# Altium schematic sheet Power stage.SchDoc (part 2 of 3)
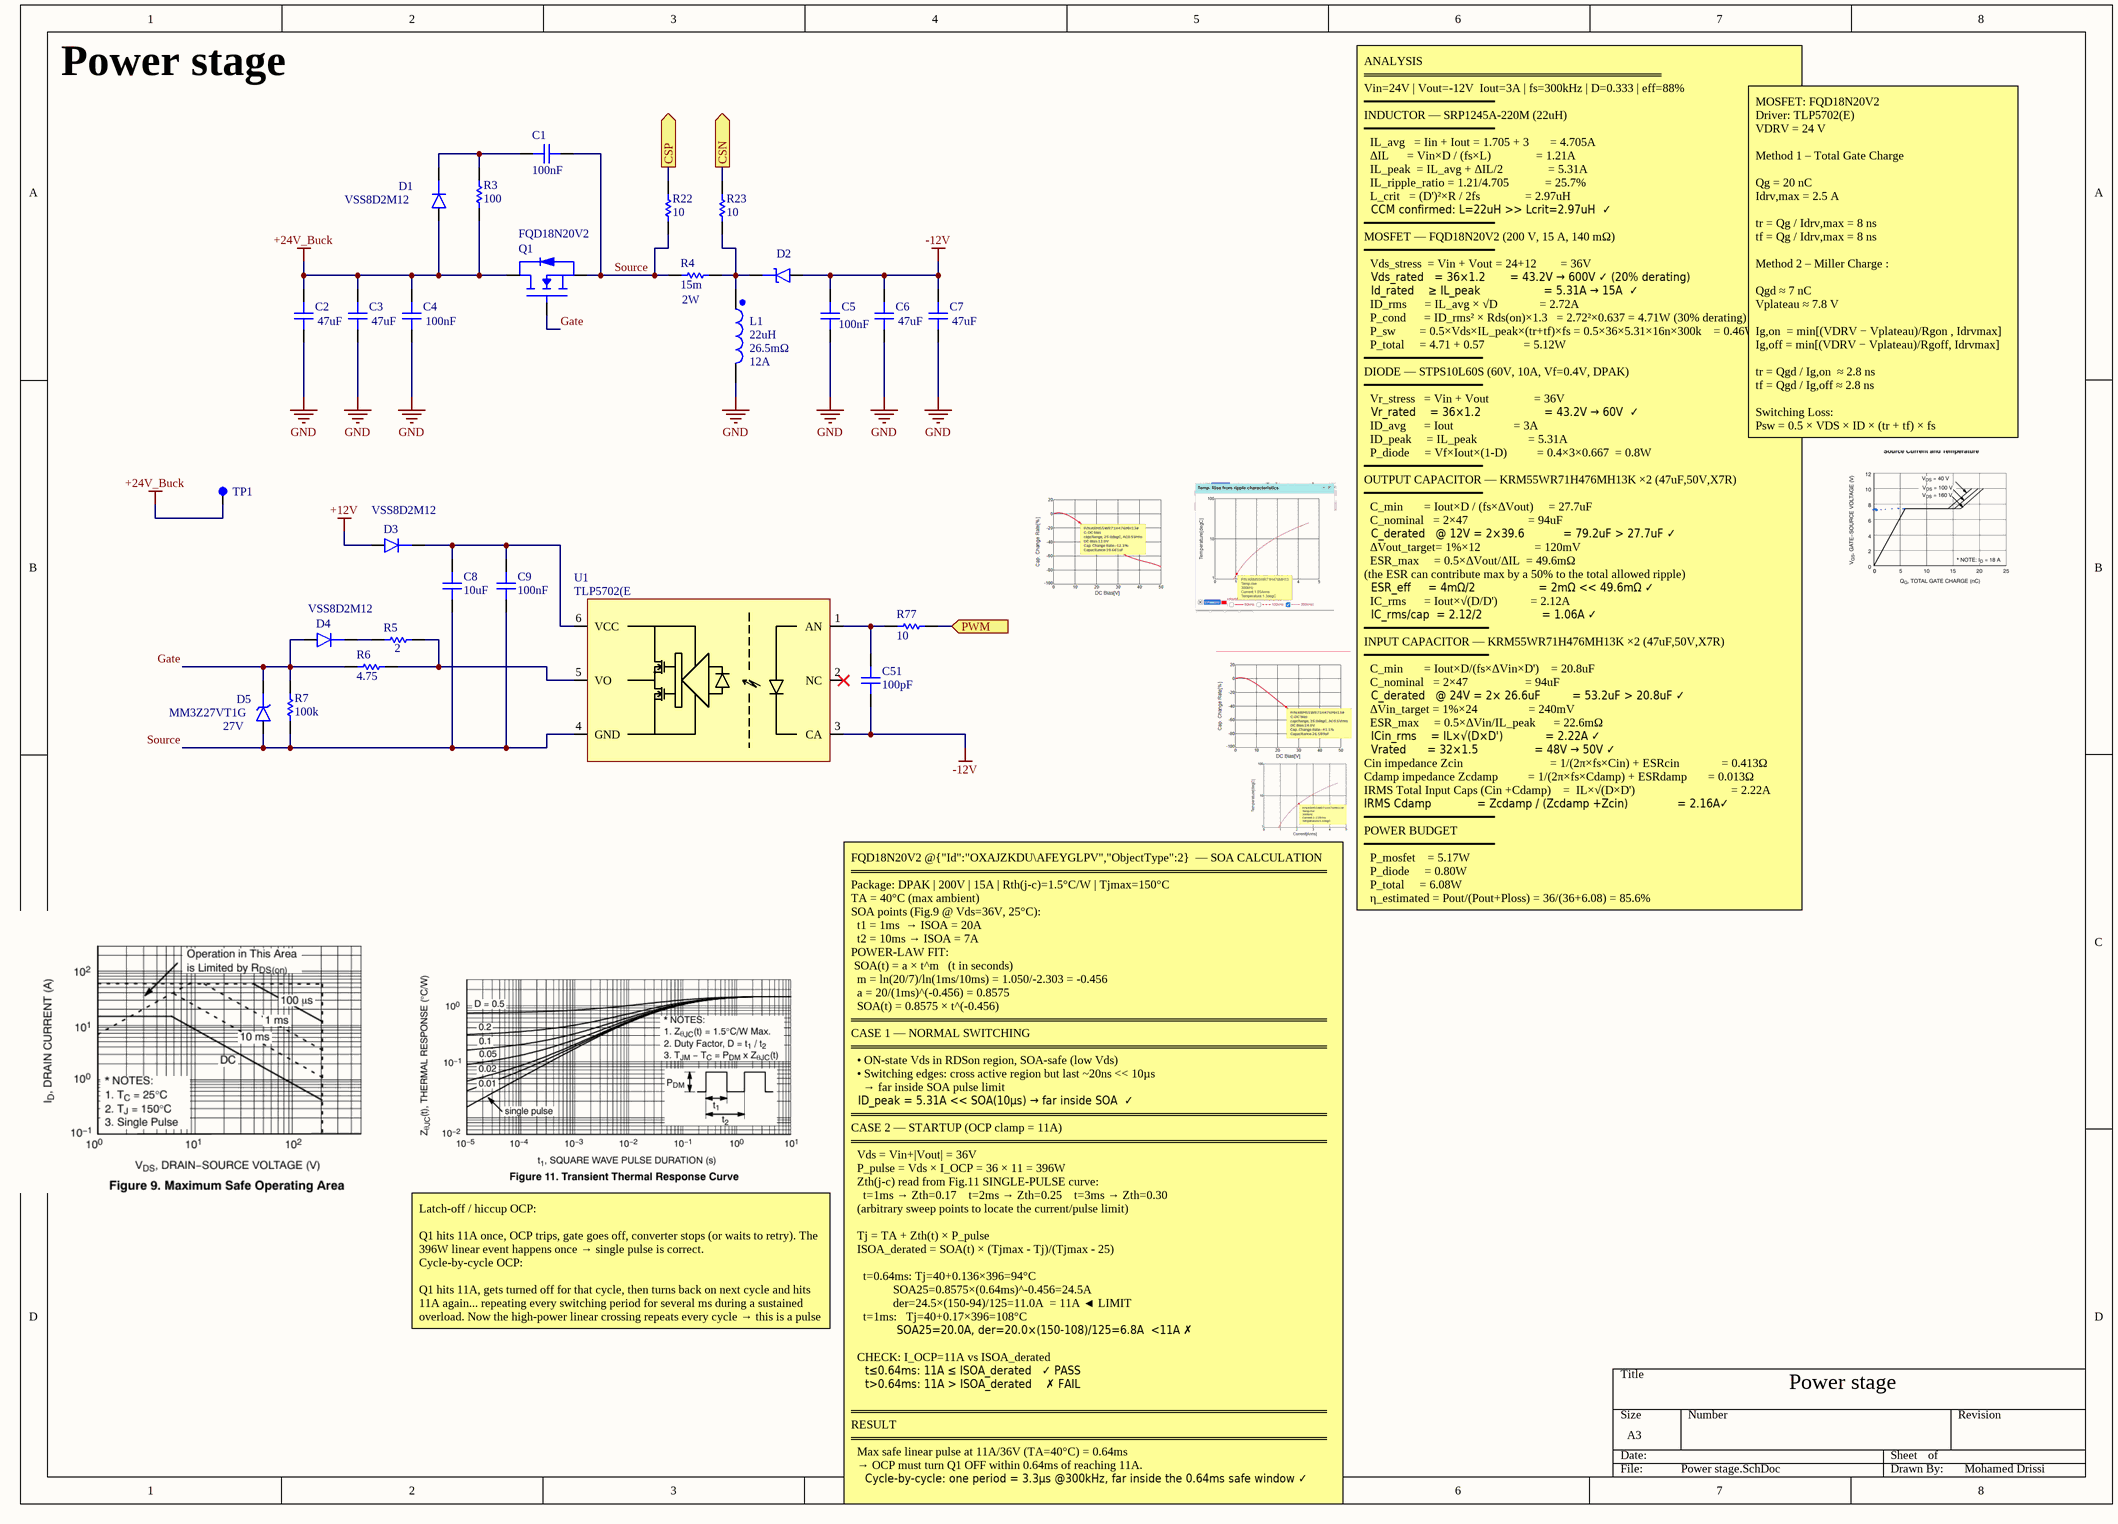
[diagram p1: Power stage.SchDoc]
## Library data of the parts
C1 C4 C5 C9 = Cal-chip GMC10X7R104K100NT: 100V 100nF X7R ±10% 0603 Multilayer Ceramic Capacitors MLCC - SMD/SMT ROHS; Manufacturer: Cal-Chip Electronics; Supplier: DigiKey; Supplier Part Number: 4713-GMC10X7R104K100NTCT-ND; Manufacturer Part Number: GMC10X7R104K100NT; RoHS: Compliant; Category: Ceramic Capacitors; Stock: 34767; Pricing: 1=0,1, 10=0,045, 50=0,0306, 100=0,0262, 500=0,01902, 1000=0,0168 (USD); Case/Package: 0603; China RoHS: Compliant; Dielectric Material: Ceramic; Height: 950µm; Length: 1.6mm; Lifecycle Status: Production; Max Operating Temperature: 125°C; Min Operating Temperature: -55°C; Mounting Technology: Surface Mount; Number of Terminals: 2; REACH SVHC: Yes; Voltage Rating (DC): 100V; Width: 800µm; ComponentLink1URL: https://datasheet.octopart.com:443/GMC10X7R104K100NT-Cal-Chip-Electronics-datasheet-182028815.pdf?src-supplier=IHS; ComponentLink1Description: https://datasheet.octopart.com:443/GMC10X7R104K100NT-Cal-Chip-Electronics-datasheet-182028815.pdf?src-supplier=IHS
C2 C3 C6 C7 = Murata KRM55WR71H476MH13K: Multilayer Ceramic Capacitors MLCC - SMD/SMT 47uF 50VDC 20% X7R; Manufacturer: Murata; Voltage Rating: 50V; Supplier: DigiKey; Supplier Part Number: 490-KRM55WR71H476MH13KCT-ND; Manufacturer Part Number: KRM55WR71H476MH13K; RoHS: Compliant; Category: Ceramic Capacitors; Stock: 10136; Pricing: 1=4,98, 10=3,591, 50=3,0356, 100=2,8638 (USD); Case/Package: 2220; Dielectric: X7R; Dielectric Material: Ceramic; Height: 6.4mm; Length: 6.1mm; Lifecycle Status: Production; Material: Ceramic; Max Operating Temperature: 125°C; Min Operating Temperature: -55°C; Mounting Technology: Surface Mount; Number of Terminals: 2; REACH SVHC: Yes; Thickness: 6.4mm; Tolerance: 20%; Voltage Rating (DC): 50V; Width: 5.3mm; ComponentLink1URL: https://datasheet.octopart.com/KRM55WR71H476MH13K-Murata-datasheet-12515295.pdf; ComponentLink1Description: https://datasheet.octopart.com/KRM55WR71H476MH13K-Murata-datasheet-12515295.pdf; ComponentLink2URL: https://datasheet.octopart.com/KRM55WR71H476MH13K-Murata-datasheet-12510076.pdf; ComponentLink2Description: https://datasheet.octopart.com/KRM55WR71H476MH13K-Murata-datasheet-12510076.pdf; ComponentLink3URL: https://datasheet.octopart.com/KRM55WR71H476MH13K-Murata-datasheet-11978611.pdf; ComponentLink3Description: https://datasheet.octopart.com/KRM55WR71H476MH13K-Murata-datasheet-11978611.pdf; ComponentLink4URL: https://datasheet.octopart.com/KRM55WR71H476MH13K-Murata-datasheet-10025737.pdf; ComponentLink4Description: https://datasheet.octopart.com/KRM55WR71H476MH13K-Murata-datasheet-10025737.pdf; ComponentLink5URL: https://datasheet.octopart.com/KRM55WR71H476MH13K-Murata-datasheet-8819587.pdf; ComponentLink5Description: https://datasheet.octopart.com/KRM55WR71H476MH13K-Murata-datasheet-8819587.pdf; ComponentLink6URL: http://sigma.octopart.com:80/reach_statement/Murata-company-16.pdf?src-supplier=Compliance+Statements; ComponentLink6Description: http://sigma.octopart.com:80/reach_statement/Murata-company-16.pdf?src-supplier=Compliance+Statements
C8 = Wurth 885012209073: Cap, 10Uf, 50V, Mlcc, 1210 Rohs Compliant: Yes |Würth Elektronik 885012209073; Manufacturer: Wurth Elektronik; Manufacturer Lifecycle Status: ACTIVE; Insulation Resistance: 10MΩ; Material: Ceramic; Tolerance: 10%; YEOL: 1 = Estimated lifetime > 10 years; Supplier: RS; Supplier Part Number: 2571123; Manufacturer Part Number: 885012209073; RoHS: Compliant; Category: Ceramic Capacitors; Stock: 1289; Pricing: 10=1,153, 100=1,081, 200=1,009, 400=0,851, 500=0,799 (EUR); Case/Package: 1210; Height: 2.5mm; Length: 3.2mm; Lifecycle Status: Production; Max Operating Temperature: 125°C; Min Operating Temperature: -55°C; Voltage Rating: 50V; Width: 2.5mm; ComponentLink1URL: https://datasheet.octopart.com:443/885012209073-Wurth-Elektronik-datasheet-166092699.pdf?src-supplier=Newark; ComponentLink1Description: https://datasheet.octopart.com:443/885012209073-Wurth-Elektronik-datasheet-166092699.pdf?src-supplier=Newark; ComponentLink2URL: https://datasheet.octopart.com:443/885012209073-W%C3%BCrth-Elektronik-datasheet-137006727.pdf?src-supplier=Wurth+Elektronik; ComponentLink2Description: https://datasheet.octopart.com:443/885012209073-W%C3%BCrth-Elektronik-datasheet-137006727.pdf?src-supplier=Wurth+Elektronik
C51 = Murata GCM1885C2A101JA16D: 100V 100pF C0G ±5% 0603 Multilayer Ceramic Capacitors MLCC - SMD/SMT ROHS; Manufacturer: Murata; Manufacturer Lifecycle Status: IN PRODUCTION; Temperature Coefficient: 30ppm/°C; Supplier: RS; Supplier Part Number: 8151323P; Manufacturer Part Number: GCM1885C2A101JA16D; RoHS: Compliant; Category: Ceramic Capacitors; Stock: 11200; Pricing: 1000=0,018, 2000=0,017, 5000=0,016, 10000=0,014 (EUR); Case/Package: 0603; Case Code (Imperial): 0603; Case Code (Metric): 1608; Depth: 800µm; Dielectric: C0G; Dielectric Material: Ceramic; Height: 800µm; Lead Free: Lead Free; Length: 1.6mm; Lifecycle Status: Production; Material: Ceramic; Max Operating Temperature: 125°C; Min Operating Temperature: -55°C; Mounting Technology: Surface Mount; Number of Terminals: 2; Radiation Hardening: No; Ratings: AEC-Q200; REACH SVHC: Yes; Schedule B: 8532240020, 8532240020|8532240020, 8532240020|8532240020|8532240020, 8532240020|8532240020|8532240020|8532240020; Termination: SMD/SMT; Tolerance: 5%; Voltage: 100V; Voltage Rating: 100V; Voltage Rating (DC): 100V; Width: 800µm; ComponentLink1URL: https://datasheet.octopart.com:443/GCM1885C2A101JA16D-Murata-datasheet-149522598.pdf?src-supplier=Farnell; ComponentLink1Description: https://datasheet.octopart.com:443/GCM1885C2A101JA16D-Murata-datasheet-149522598.pdf?src-supplier=Farnell; ComponentLink2URL: https://datasheet.octopart.com:443/GCM1885C2A101JA16D-Murata-datasheet-104277829.pdf?src-supplier=Newark; ComponentLink2Description: https://datasheet.octopart.com:443/GCM1885C2A101JA16D-Murata-datasheet-104277829.pdf?src-supplier=Newark; ComponentLink3URL: https://datasheet.octopart.com:443/GCM1885C2A101JA16D-Murata-datasheet-141266551.pdf?src-supplier=Geoflip; ComponentLink3Description: https://datasheet.octopart.com:443/GCM1885C2A101JA16D-Murata-datasheet-141266551.pdf?src-supplier=Geoflip; ComponentLink4URL: https://datasheet.octopart.com:443/GCM1885C2A101JA16D-Murata-datasheet-14404397.pdf?src-supplier=Future+Electronics; ComponentLink4Description: https://datasheet.octopart.com:443/GCM1885C2A101JA16D-Murata-datasheet-14404397.pdf?src-supplier=Future+Electronics; ComponentLink5URL: https://datasheet.octopart.com:443/GCM1885C2A101JA16D-Murata-datasheet-12524712.pdf?src-supplier=Future+Electronics; ComponentLink5Description: https://datasheet.octopart.com:443/GCM1885C2A101JA16D-Murata-datasheet-12524712.pdf?src-supplier=Future+Electronics; ComponentLink6URL: https://datasheet.octopart.com:443/GCM1885C2A101JA16D-Murata-datasheet-44104441.pdf?src-supplier=Future+Electronics; ComponentLink6Description: https://datasheet.octopart.com:443/GCM1885C2A101JA16D-Murata-datasheet-44104441.pdf?src-supplier=Future+Electronics; ComponentLink7URL: https://datasheet.octopart.com:443/GCM1885C2A101JA16D-Murata-datasheet-140657395.pdf?src-supplier=Ciiva; ComponentLink7Description: https://datasheet.octopart.com:443/GCM1885C2A101JA16D-Murata-datasheet-140657395.pdf?src-supplier=Ciiva; ComponentLink8URL: https://datasheet.octopart.com:443/GCM1885C2A101JA16D-Murata-datasheet-138717052.pdf?src-supplier=Ciiva; ComponentLink8Description: https://datasheet.octopart.com:443/GCM1885C2A101JA16D-Murata-datasheet-138717052.pdf?src-supplier=Ciiva; ComponentLink9URL: https://datasheet.octopart.com:443/GCM1885C2A101JA16D-Murata-datasheet-141971842.pdf?src-supplier=Arrow.cn; ComponentLink9Description: https://datasheet.octopart.com:443/GCM1885C2A101JA16D-Murata-datasheet-141971842.pdf?src-supplier=Arrow.cn; ComponentLink10URL: https://datasheet.octopart.com:443/GCM1885C2A101JA16D-Murata-datasheet-12511495.pdf?src-supplier=TME; ComponentLink10Description: https://datasheet.octopart.com:443/GCM1885C2A101JA16D-Murata-datasheet-12511495.pdf?src-supplier=TME; ComponentLink11URL: http://sigma.octopart.com:80/reach_statement/Murata-company-16.pdf?src-supplier=Compliance+Statements; ComponentLink11Description: http://sigma.octopart.com:80/reach_statement/Murata-company-16.pdf?src-supplier=Compliance+Statements
D1 D3 D4 = Vishay VSS8D2M12-M3/H: Rectifier Diode, Schottky, 1 Phase, 1 Element, 2A, 120V V(RRM), Silicon, DO-221AD; Manufacturer: Vishay; Forward Voltage: 810mV; Max Forward Surge Current (Ifsm): 50A; Number of Elements: 1; Peak Reverse Current: 250µA; Supplier: RS; Supplier Part Number: 2190367; Manufacturer Part Number: VSS8D2M12-M3/H; RoHS: Compliant; Category: Rectifier Diodes; Stock: 13750; Pricing: 50=0,204 (EUR); Lifecycle Status: Production; Max Operating Temperature: 175°C; Max Output current: 2A; Min Operating Temperature: -40°C; Number of Terminals: 2; Reverse Standoff Voltage: 120V; ComponentLink1URL: https://datasheet.octopart.com:443/VSS8D2M12-M3-H-Vishay-datasheet-181480222.pdf?src-supplier=Newark; ComponentLink1Description: https://datasheet.octopart.com:443/VSS8D2M12-M3-H-Vishay-datasheet-181480222.pdf?src-supplier=Newark; ComponentLink2URL: http://sigma.octopart.com:80/rohs_statement/Vishay-company-15.pdf?src-supplier=Compliance+Statements; ComponentLink2Description: http://sigma.octopart.com:80/rohs_statement/Vishay-company-15.pdf?src-supplier=Compliance+Statements
D2 = ST STPS10L60D: Rectifier Diode, Schottky, 1 Phase, 1 Element, 10A, 60V V(RRM), Silicon, TO-220AC; Manufacturer: STMicroelectronics; Element Configuration: Single; Forward Voltage: 740mV; Max Forward Surge Current (Ifsm): 220A; Max Junction Temperature (Tj): 150°C; Max Reverse Leakage Current: 350µA; Number of Elements: 1; Polarity: Standard; Supplier: Future Electronics; Supplier Part Number: STPS10L60D; Manufacturer Part Number: STPS10L60D; RoHS: Compliant; Category: Schottky Diodes; Stock: 200; Pricing: 100=0,22, 250=0,215, 1000=0,21, 2500=0,205, 6250=0,2 (USD); Average Rectified Current: 10A; Case/Package: TO-220-2; China RoHS: Non-Compliant; Contact Plating: Tin; Current Rating: 10A; Forward Current: 10A; Lead Free: Lead Free; Lifecycle Status: Production; Max Operating Temperature: 150°C; Max Output current: 10A; Max Repetitive Reverse Voltage (Vrrm): 60V; Max Reverse Voltage (DC): 60V; Max Surge Current: 220A; Min Operating Temperature: -65°C; Mounting Technology: Through Hole; Pins: 2; Number of Terminals: 2; Output Current: 10A; Peak Non-Repetitive Surge Current: 220A; Peak Reverse Current: 350µA; Radiation Hardening: No; REACH SVHC: No; Reverse Standoff Voltage: 60V; Voltage Rating (DC): 60V; ComponentLink1URL: https://datasheet.octopart.com:443/STPS10L60D-STMicroelectronics-datasheet-13237.pdf?src-supplier=Factory+Futures; ComponentLink1Description: https://datasheet.octopart.com:443/STPS10L60D-STMicroelectronics-datasheet-13237.pdf?src-supplier=Factory+Futures; ComponentLink2URL: https://datasheet.octopart.com:443/STPS10L60D-STMicroelectronics-datasheet-12545639.pdf?src-supplier=Newark; ComponentLink2Description: https://datasheet.octopart.com:443/STPS10L60D-STMicroelectronics-datasheet-12545639.pdf?src-supplier=Newark; ComponentLink3URL: https://datasheet.octopart.com:443/STPS10L60D-STMicroelectronics-datasheet-134532140.pdf?src-supplier=Newark; ComponentLink3Description: https://datasheet.octopart.com:443/STPS10L60D-STMicroelectronics-datasheet-134532140.pdf?src-supplier=Newark; ComponentLink4URL: https://datasheet.octopart.com:443/STPS10L60D-STMicroelectronics-datasheet-14054965.pdf?src-supplier=iiiC; ComponentLink4Description: https://datasheet.octopart.com:443/STPS10L60D-STMicroelectronics-datasheet-14054965.pdf?src-supplier=iiiC
D5 = Onsemi MM3Z27VT1G: Diode, Zener, Vr 27V, If 10MA, Pkg SOD-323, Vf 0.9V, Cj 70PF, Tj +150C, Pd 200MW, Ir 2MA; Manufacturer: onsemi; Manufacturer Lifecycle Status: ACTIVE; Element Configuration: Single; ESD Protection: Yes; Forward Voltage: 900mV; Impedance: 80Ω; Material: Plastic; Max Power Dissipation: 300mW; Max Reverse Leakage Current: 50nA; Number of Elements: 1; Polarity: Unidirectional; Reverse Standoff Voltage: 18.9V; Tolerance: 7%; Voltage Tolerance: 7.04%; Supplier: Future Electronics; Supplier Part Number: MM3Z27VT1G; Manufacturer Part Number: MM3Z27VT1G; RoHS: Compliant; Category: Zener Diodes; Stock: 492000; Pricing: 3000=0,0226, 9000=0,0221, 15000=0,0218, 45000=0,0213, 75000=0,0208 (USD); Case/Package: SOD-323-2; China RoHS: Compliant; Composition: Zener; Contact Plating: Tin; Country of Origin: Mainland China; Export Control Classification Number (ECCN) Code: EAR99; Height: 990.6µm; Harmonized Tariff Schedule (HTS) Code: 8541.10.00.50; Introduction Date: 2001-05-19; Lead Free: Lead Free; Length: 1.778mm; Lifecycle Status: Production; Max Operating Temperature: 150°C; Min Operating Temperature: -65°C; Pins: 2; Number of Terminals: 2; Packaging: Tape and Reel; Peak Reverse Current: 50nA; Power Dissipation: 200mW; Power Rating: 200mW; Radiation Hardening: No; REACH SVHC: Yes; Schedule B: 8541100050, 8541100050|8541100050, 8541100050|8541100050|8541100050, 8541100050|8541100050|8541100050|8541100050; Test Current: 2mA; Voltage Rating (DC): 27V; Width: 1.3462mm; Working Voltage: 27V; Zener Current: 2mA; Zener Voltage: 27V; ComponentLink1URL: https://datasheet.octopart.com:443/MM3Z27VT1G-onsemi-datasheet-180963385.pdf?src-supplier=IHS; ComponentLink1Description: https://datasheet.octopart.com:443/MM3Z27VT1G-onsemi-datasheet-180963385.pdf?src-supplier=IHS; ComponentLink2URL: https://datasheet.octopart.com:443/MM3Z27VT1G-ON-Semiconductor-datasheet-10854552.pdf?src-supplier=Farnell; ComponentLink2Description: https://datasheet.octopart.com:443/MM3Z27VT1G-ON-Semiconductor-datasheet-10854552.pdf?src-supplier=Farnell; ComponentLink3URL: https://datasheet.octopart.com:443/MM3Z27VT1G-ON-Semiconductor-datasheet-153454.pdf?src-supplier=Farnell; ComponentLink3Description: https://datasheet.octopart.com:443/MM3Z27VT1G-ON-Semiconductor-datasheet-153454.pdf?src-supplier=Farnell; ComponentLink4URL: https://datasheet.octopart.com:443/MM3Z27VT1G-ON-Semiconductor-datasheet-34436552.pdf?src-supplier=Farnell; ComponentLink4Description: https://datasheet.octopart.com:443/MM3Z27VT1G-ON-Semiconductor-datasheet-34436552.pdf?src-supplier=Farnell; ComponentLink5URL: https://datasheet.octopart.com:443/MM3Z27VT1G-ON-Semiconductor-datasheet-34219234.pdf?src-supplier=Farnell; ComponentLink5Description: https://datasheet.octopart.com:443/MM3Z27VT1G-ON-Semiconductor-datasheet-34219234.pdf?src-supplier=Farnell; ComponentLink6URL: https://datasheet.octopart.com:443/MM3Z27VT1G-ON-Semiconductor-datasheet-141916669.pdf?src-supplier=Upverter; ComponentLink6Description: https://datasheet.octopart.com:443/MM3Z27VT1G-ON-Semiconductor-datasheet-141916669.pdf?src-supplier=Upverter; ComponentLink7URL: https://datasheet.octopart.com:443/MM3Z27VT1G-onsemi-datasheet-166322658.pdf?src-supplier=Newark; ComponentLink7Description: https://datasheet.octopart.com:443/MM3Z27VT1G-onsemi-datasheet-166322658.pdf?src-supplier=Newark; ComponentLink8URL: https://datasheet.octopart.com:443/MM3Z27VT1G-ON-Semiconductor-datasheet-10405520.pdf?src-supplier=HQonline; ComponentLink8Description: https://datasheet.octopart.com:443/MM3Z27VT1G-ON-Semiconductor-datasheet-10405520.pdf?src-supplier=HQonline; ComponentLink9URL: https://datasheet.octopart.com:443/MM3Z27VT1G-onsemi-datasheet-188912692.pdf?src-supplier=TME; ComponentLink9Description: https://datasheet.octopart.com:443/MM3Z27VT1G-onsemi-datasheet-188912692.pdf?src-supplier=TME; ComponentLink10URL: https://datasheet.octopart.com:443/MM3Z27VT1G-onsemi-datasheet-166742605.pdf?src-supplier=TME; ComponentLink10Description: https://datasheet.octopart.com:443/MM3Z27VT1G-onsemi-datasheet-166742605.pdf?src-supplier=TME; ComponentLink11URL: https://datasheet.octopart.com:443/MM3Z27VT1G-ON-Semiconductor-datasheet-9566415.pdf?src-supplier=RS+(Formerly+Allied+Electronics); ComponentLink11Description: https://datasheet.octopart.com:443/MM3Z27VT1G-ON-Semiconductor-datasheet-9566415.pdf?src-supplier=RS+(Formerly+Allied+Electronics); ComponentLink12URL: http://sigma.octopart.com:80/150617830/rohs_statement/ON-Semiconductor-MM3Z27VT1G.pdf?src-supplier=Compliance+Statements; ComponentLink12Description: http://sigma.octopart.com:80/150617830/rohs_statement/ON-Semiconductor-MM3Z27VT1G.pdf?src-supplier=Compliance+Statements; ComponentLink13URL: http://sigma.octopart.com:80/reach_statement/ON-Semiconductor-company-79.pdf?src-supplier=Compliance+Statements; ComponentLink13Description: http://sigma.octopart.com:80/reach_statement/ON-Semiconductor-company-79.pdf?src-supplier=Compliance+Statements; ComponentLink14URL: https://octopart.com:443/opatz8j6/c1?t=X0TbtuEJkvB0hDdM0us222cWL80QeJYg8O_QdScqauBBUDCFxua7_rdkly_dNg_Yh86icTcmpvu74iIbrg-GkgRFkwtfWIcRcGlGxH4kG8XR6bHyjE6Pa_9ps11wSUEXHSDaWdDJ36DGMb0TToR-_hsWlBgUxmxxclRgS-BEqH7Q-gMLVs_yUWYRoPU2-B18qsbbTt8iVL-41g_E9jpcb0isizsrhkArARiB4VzwcNxWE92V8JR_4IM5ydACa2NGKUzR7Oa7JwTTXg9ESsLKX83t7v0P9KDrUEt9voTKRu3hVDY7DTyvhFYldiNFYrTnHy7-rLKsYI8CxCrRiZ0APmc7kbeCUiWBQZkFJw&src-supplier=Compliance+Statements; ComponentLink14Description: https://octopart.com:443/opatz8j6/c1?t=X0TbtuEJkvB0hDdM0us222cWL80QeJYg8O_QdScqauBBUDCFxua7_rdkly_dNg_Yh86icTcmpvu74iIbrg-GkgRFkwtfWIcRcGlGxH4kG8XR6bHyjE6Pa_9ps11wSUEXHSDaWdDJ36DGMb0TToR-_hsWlBgUxmxxclRgS-BEqH7Q-gMLVs_yUWYRoPU2-B18qsbbTt8iVL-41g_E9jpcb0isizsrhkArARiB4VzwcNxWE92V8JR_4IM5ydACa2NGKUzR7Oa7JwTTXg9ESsLKX83t7v0P9KDrUEt9voTKRu3hVDY7DTyvhFYldiNFYrTnHy7-rLKsYI8CxCrRiZ0APmc7kbeCUiWBQZkFJw&src-supplier=Compliance+Statements; ComponentLink15URL: https://octopart.com:443/opatz8j6/c1?t=_jnRK6WbDFLFWShGurbqc0M3zwWF74ykEZWfYiM0TpOiGHey8KAgwrBX0Ee2IvVR1FTVCtzG-it88Mx-c64x4FVqtlPCU1l6a3uCUSwp5USUAaZcXFwb3f2ou9vRyJHPw4yIfMjF63DMnxWFBgdrqDUvWaXGb38cde5t5jo0NAWlnj5DmfF0wdKf1EFxkFgp-IK1smEjivucrfDgJ4Rgzkj_YmS364h9_IdsrDxg_zpkn1QPR7xRi-nutM2QlnDqMK-nzYu8fG1f3SBN1WDlOW2yiyq2yY_SdNOURBp9cJ4YVgpJ1l5--ejywhUp_rQrrdbI8xCxAni3WYyT0JBShWR3zYbKpyZi_fW0&src-supplier=Compliance+Statements; ComponentLink15Description: https://octopart.com:443/opatz8j6/c1?t=_jnRK6WbDFLFWShGurbqc0M3zwWF74ykEZWfYiM0TpOiGHey8KAgwrBX0Ee2IvVR1FTVCtzG-it88Mx-c64x4FVqtlPCU1l6a3uCUSwp5USUAaZcXFwb3f2ou9vRyJHPw4yIfMjF63DMnxWFBgdrqDUvWaXGb38cde5t5jo0NAWlnj5DmfF0wdKf1EFxkFgp-IK1smEjivucrfDgJ4Rgzkj_YmS364h9_IdsrDxg_zpkn1QPR7xRi-nutM2QlnDqMK-nzYu8fG1f3SBN1WDlOW2yiyq2yY_SdNOURBp9cJ4YVgpJ1l5--ejywhUp_rQrrdbI8xCxAni3WYyT0JBShWR3zYbKpyZi_fW0&src-supplier=Compliance+Statements
L1 = Shenzen MWLA1707S-220MT: General Purpose Inductor, 22uH, 20%, 1 Element, Wirewound-Core, SMD, 6967; Manufacturer: Sunlord; Number of Circuits: 1; Shielding: Shielded; Test Frequency: 100kHz; Supplier: DigiKey; Supplier Part Number: 3442-MWLA1707S-220MTCT-ND; Manufacturer Part Number: MWLA1707S-220MT; Category: Fixed Inductors; Stock: 255; Pricing: 1=1,94, 10=1,595, 100=1,3118 (USD); Height: 7mm; Length: 17.5mm; Lifecycle Status: Production; Max Operating Temperature: 125°C; Min Operating Temperature: -55°C; Number of Terminals: 2; Tolerance: 20%; Width: 17mm
Q1 = Onsemi FQD18N20V2TM: N-Channel Power MOSFET, QFET®, 200 V, 15 A, 140 mΩ, DPAK; Manufacturer: onsemi; Manufacturer Lifecycle Status: ACTIVE; Continuous Drain Current (ID): 15A; Drain to Source Breakdown Voltage: 200V; Drain to Source Resistance: 140mΩ; Element Configuration: Single; Fall Time: 62ns; Gate to Source Voltage (Vgs): 30V; Input Capacitance: 1.08nF; Max Junction Temperature (Tj): 150°C; Max Power Dissipation: 83W; Nominal Vgs: 5V; Number of Channels: 1; Power Dissipation: 2.5W; RDSon: 140m; Rise Time: 133ns; Turn-Off Delay Time: 38ns; Turn-On Delay Time: 16ns; Supplier: RS; Supplier Part Number: 1867921; Manufacturer Part Number: FQD18N20V2TM; RoHS: Compliant; Category: MOSFETs; Stock: 1170; Pricing: 10=1,189, 100=0,892, 250=0,881, 500=0,758, 1000=0,618 (EUR); Case/Package: DPAK; China RoHS: Non-Compliant; Contact Plating: Tin; Country of Origin: Mainland China; Current Rating: 15A; Drain to Source Voltage (Vdss): 200V; Export Control Classification Number (ECCN) Code: EAR99; Height: 2.517mm; Harmonized Tariff Schedule (HTS) Code: 8541.29.00.95; Introduction Date: 2002-07-31; Lead Free: Lead Free; Length: 6.6mm; Lifecycle Status: Production; Max Operating Temperature: 150°C; Min Breakdown Voltage: 200V; Min Operating Temperature: -55°C; Mounting Technology: Surface Mount; Number of Elements: 1; Pins: 3; Number of Terminals: 2; Radiation Hardening: No; Rds On Max: 140mΩ; REACH SVHC: No; Schedule B: 8541290080, 8541290080|8541290080|8541290080|8541290080|8541290080; Voltage Rating (DC): 200V; Weight: 260.37mg; ComponentLink1URL: https://sigma.octopart.com:443/138897554/technical_drawing/ON-Semiconductor-FQD18N20V2TM.pdf?src-supplier=Upverter; ComponentLink1Description: https://sigma.octopart.com:443/138897554/technical_drawing/ON-Semiconductor-FQD18N20V2TM.pdf?src-supplier=Upverter; ComponentLink2URL: https://datasheet.octopart.com:443/FQD18N20V2TM-ON-Semiconductor-datasheet-86696078.pdf?src-supplier=Master+Electronics; ComponentLink2Description: https://datasheet.octopart.com:443/FQD18N20V2TM-ON-Semiconductor-datasheet-86696078.pdf?src-supplier=Master+Electronics; ComponentLink3URL: https://datasheet.octopart.com:443/FQD18N20V2TM-ON-Semiconductor-datasheet-137405633.pdf?src-supplier=IHS; ComponentLink3Description: https://datasheet.octopart.com:443/FQD18N20V2TM-ON-Semiconductor-datasheet-137405633.pdf?src-supplier=IHS; ComponentLink4URL: https://datasheet.octopart.com:443/FQD18N20V2TM-Fairchild-Semiconductor-datasheet-182293766.pdf?src-supplier=IHS; ComponentLink4Description: https://datasheet.octopart.com:443/FQD18N20V2TM-Fairchild-Semiconductor-datasheet-182293766.pdf?src-supplier=IHS; ComponentLink5URL: https://datasheet.octopart.com:443/FQD18N20V2TM-ON-Semiconductor-datasheet-85529587.pdf?src-supplier=onsemi; ComponentLink5Description: https://datasheet.octopart.com:443/FQD18N20V2TM-ON-Semiconductor-datasheet-85529587.pdf?src-supplier=onsemi; ComponentLink6URL: https://datasheet.octopart.com:443/FQD18N20V2TM-ON-Semiconductor-datasheet-22973400.pdf?src-supplier=Fairchild+Semiconductor; ComponentLink6Description: https://datasheet.octopart.com:443/FQD18N20V2TM-ON-Semiconductor-datasheet-22973400.pdf?src-supplier=Fairchild+Semiconductor; ComponentLink7URL: https://datasheet.octopart.com:443/FQD18N20V2TM-Fairchild-datasheet-5437142.pdf?src-supplier=Fairchild+Semiconductor; ComponentLink7Description: https://datasheet.octopart.com:443/FQD18N20V2TM-Fairchild-datasheet-5437142.pdf?src-supplier=Fairchild+Semiconductor; ComponentLink8URL: https://sigma.octopart.com:443/33068866/technical_drawing/Fairchild-Semiconductor-FQD18N20V2TM.pdf?src-supplier=Fairchild+Semiconductor; ComponentLink8Description: https://sigma.octopart.com:443/33068866/technical_drawing/Fairchild-Semiconductor-FQD18N20V2TM.pdf?src-supplier=Fairchild+Semiconductor; ComponentLink9URL: https://sigma.octopart.com:443/17346108/technical_drawing/Fairchild-Semiconductor-FQD18N20V2TM.pdf?src-supplier=Fairchild+Semiconductor; ComponentLink9Description: https://sigma.octopart.com:443/17346108/technical_drawing/Fairchild-Semiconductor-FQD18N20V2TM.pdf?src-supplier=Fairchild+Semiconductor; ComponentLink10URL: https://datasheet.octopart.com:443/FQD18N20V2TM-Fairchild-Semiconductor-datasheet-21379560.pdf?src-supplier=Farnell; ComponentLink10Description: https://datasheet.octopart.com:443/FQD18N20V2TM-Fairchild-Semiconductor-datasheet-21379560.pdf?src-supplier=Farnell; ComponentLink11URL: https://datasheet.octopart.com:443/FQD18N20V2TM-ON-Semiconductor-datasheet-86690119.pdf?src-supplier=Farnell; ComponentLink11Description: https://datasheet.octopart.com:443/FQD18N20V2TM-ON-Semiconductor-datasheet-86690119.pdf?src-supplier=Farnell; ComponentLink12URL: https://datasheet.octopart.com:443/FQD18N20V2TM-Fairchild-Semiconductor-datasheet-21199379.pdf?src-supplier=Newark; ComponentLink12Description: https://datasheet.octopart.com:443/FQD18N20V2TM-Fairchild-Semiconductor-datasheet-21199379.pdf?src-supplier=Newark; ComponentLink13URL: https://datasheet.octopart.com:443/FQD18N20V2TM-Fairchild-datasheet-119005.pdf?src-supplier=DigiKey; ComponentLink13Description: https://datasheet.octopart.com:443/FQD18N20V2TM-Fairchild-datasheet-119005.pdf?src-supplier=DigiKey; ComponentLink14URL: https://datasheet.octopart.com:443/FQD18N20V2TM-Fairchild-datasheet-164522.pdf?src-supplier=Mouser; ComponentLink14Description: https://datasheet.octopart.com:443/FQD18N20V2TM-Fairchild-datasheet-164522.pdf?src-supplier=Mouser; ComponentLink15URL: https://datasheet.octopart.com:443/FQD18N20V2TM-ON-Semiconductor-datasheet-81454925.pdf?src-supplier=TME; ComponentLink15Description: https://datasheet.octopart.com:443/FQD18N20V2TM-ON-Semiconductor-datasheet-81454925.pdf?src-supplier=TME; ComponentLink16URL: http://sigma.octopart.com:80/150610893/rohs_statement/ON-Semiconductor-FQD18N20V2TM.pdf?src-supplier=Compliance+Statements; ComponentLink16Description: http://sigma.octopart.com:80/150610893/rohs_statement/ON-Semiconductor-FQD18N20V2TM.pdf?src-supplier=Compliance+Statements; ComponentLink17URL: http://sigma.octopart.com:80/17350712/reach_statement/Fairchild-Semiconductor-FQD18N20V2TM.pdf?src-supplier=Compliance+Statements; ComponentLink17Description: http://sigma.octopart.com:80/17350712/reach_statement/Fairchild-Semiconductor-FQD18N20V2TM.pdf?src-supplier=Compliance+Statements; ComponentLink18URL: http://sigma.octopart.com:80/17350713/materials_sheet/Fairchild-Semiconductor-FQD18N20V2TM.pdf?src-supplier=Compliance+Statements; ComponentLink18Description: http://sigma.octopart.com:80/17350713/materials_sheet/Fairchild-Semiconductor-FQD18N20V2TM.pdf?src-supplier=Compliance+Statements; ComponentLink19URL: http://sigma.octopart.com:80/33170041/reach_statement/Fairchild-Semiconductor-FQD18N20V2TM.pdf?src-supplier=Compliance+Statements; ComponentLink19Description: http://sigma.octopart.com:80/33170041/reach_statement/Fairchild-Semiconductor-FQD18N20V2TM.pdf?src-supplier=Compliance+Statements; ComponentLink20URL: http://sigma.octopart.com:80/33170043/materials_sheet/Fairchild-Semiconductor-FQD18N20V2TM.pdf?src-supplier=Compliance+Statements; ComponentLink20Description: http://sigma.octopart.com:80/33170043/materials_sheet/Fairchild-Semiconductor-FQD18N20V2TM.pdf?src-supplier=Compliance+Statements; ComponentLink21URL: http://sigma.octopart.com:80/reach_statement/ON-Semiconductor-company-79.pdf?src-supplier=Compliance+Statements; ComponentLink21Description: http://sigma.octopart.com:80/reach_statement/ON-Semiconductor-company-79.pdf?src-supplier=Compliance+Statements; ComponentLink22URL: http://sigma.octopart.com:80/rohs_statement/Fairchild-Semiconductor-company-11.pdf?src-supplier=Compliance+Statements; ComponentLink22Description: http://sigma.octopart.com:80/rohs_statement/Fairchild-Semiconductor-company-11.pdf?src-supplier=Compliance+Statements; ComponentLink23URL: http://sigma.octopart.com:80/rohs_statement/Fairchild-Semiconductor-company-10.pdf?src-supplier=Compliance+Statements; ComponentLink23Description: http://sigma.octopart.com:80/rohs_statement/Fairchild-Semiconductor-company-10.pdf?src-supplier=Compliance+Statements; ComponentLink24URL: http://sigma.octopart.com:80/reach_statement/Fairchild-Semiconductor-company-9.pdf?src-supplier=Compliance+Statements; ComponentLink24Description: http://sigma.octopart.com:80/reach_statement/Fairchild-Semiconductor-company-9.pdf?src-supplier=Compliance+Statements; ComponentLink25URL: https://octopart.com:443/opatz8j6/c1?t=tss-XeP9tjDBY0S5GIM6_ULKEAYnQ3OmKS0bak7yZA8PK3ZgT-NOJgWRtgiQsWLCGa3IIm3D0Qc2j46udU123FQaI02lpNcV9fpPWsV0v4VKQGAtggwtfSSwk3oZdQir_OT0Gj_zFjiit2YLxdvIou5f9I-M_oCTybRLzqBaJb6Do9SdTFoUKQYwq4osiJlIYL5LgwJJTZ1UaIBxQipEy-vOBFCO_-JzP3zLx3410mxJg-5ytRAIdvwv3VVZliv5IjKLS7zbeYKGz95qWzIFTSzU3Xco3PBK5nsud0XbSvcV41SJUKJyDIkzorUNquc7-T7jTI8qeXLD3gP6WeV27mEPR1TyYlg-pHMl0_THKB8&src-supplier=Compliance+Statements; ComponentLink25Description: https://octopart.com:443/opatz8j6/c1?t=tss-XeP9tjDBY0S5GIM6_ULKEAYnQ3OmKS0bak7yZA8PK3ZgT-NOJgWRtgiQsWLCGa3IIm3D0Qc2j46udU123FQaI02lpNcV9fpPWsV0v4VKQGAtggwtfSSwk3oZdQir_OT0Gj_zFjiit2YLxdvIou5f9I-M_oCTybRLzqBaJb6Do9SdTFoUKQYwq4osiJlIYL5LgwJJTZ1UaIBxQipEy-vOBFCO_-JzP3zLx3410mxJg-5ytRAIdvwv3VVZliv5IjKLS7zbeYKGz95qWzIFTSzU3Xco3PBK5nsud0XbSvcV41SJUKJyDIkzorUNquc7-T7jTI8qeXLD3gP6WeV27mEPR1TyYlg-pHMl0_THKB8&src-supplier=Compliance+Statements; ComponentLink26URL: https://octopart.com:443/opatz8j6/c1?t=DpaQ-zW78t5OzW7J6WwPSdjvKUm_l3gMXCNgqQLiCO716UNLj9V6qpZTwKdfeZUwbM88J6NQwDH2acK-stHF5Z4ruH174_o9UHhCwyQdtGjwmNB0KtG1bm5s6VcLEoGQiEwZwpD5iE2EzMyX2QyfGbyRVQYRjqTqLckh1hz8aajdFY9iItU0-iIatPgFe19cr7MVSridAjgqTbaKkxOe9MmEmD27uoYzO9mEeH__5aG7SmFinNIqzol1lO__se7wI5SEqAMcK9c801dgsUYSbDLpYsB9L_0T7nbxsaAWxABB4RSTl7T0H2ZOMdpMiL9oj7EVur-7N9vx6mtGUaRnhhcL3inIqsaVlj0SfGzdaA&src-supplier=Compliance+Statements; ComponentLink26Description: https://octopart.com:443/opatz8j6/c1?t=DpaQ-zW78t5OzW7J6WwPSdjvKUm_l3gMXCNgqQLiCO716UNLj9V6qpZTwKdfeZUwbM88J6NQwDH2acK-stHF5Z4ruH174_o9UHhCwyQdtGjwmNB0KtG1bm5s6VcLEoGQiEwZwpD5iE2EzMyX2QyfGbyRVQYRjqTqLckh1hz8aajdFY9iItU0-iIatPgFe19cr7MVSridAjgqTbaKkxOe9MmEmD27uoYzO9mEeH__5aG7SmFinNIqzol1lO__se7wI5SEqAMcK9c801dgsUYSbDLpYsB9L_0T7nbxsaAWxABB4RSTl7T0H2ZOMdpMiL9oj7EVur-7N9vx6mtGUaRnhhcL3inIqsaVlj0SfGzdaA&src-supplier=Compliance+Statements
R3 = Susumu CPA2512E1000FS-T10: RES SMD 100 OHM 1% 16W 2512 / 100 Ohms ±1% 16W Chip Resistor 2512 (6432 Metric) Moisture Resistant Thin Film; Manufacturer: Susumu; Temperature Coefficient: 25ppm/°C; Supplier: DigiKey; Supplier Part Number: CPA25E100CT-ND; Manufacturer Part Number: CPA2512E1000FS-T10; RoHS: Compliant; Category: Chip SMD Resistors; Stock: 38476; Pricing: 1=2,16, 10=1,786, 25=1,6584, 50=1,57, 100=1,4894, 250=1,39452, 500=1,33128 (USD); Case/Package: 2512; Case Code (Imperial): 2512; Case Code (Metric): 6432; Composition: Thin Film; Country of Origin: Japan, Mainland China; Export Control Classification Number (ECCN) Code: EAR99; Features: Moisture Resistant; Height: 700µm; Introduction Date: 2008-09-12; Lead Free: Lead Free; Length: 6.3mm; Lifecycle Status: Production; Max Operating Temperature: 155°C; Max Power Dissipation: 16W; Min Operating Temperature: -55°C; Mounting Technology: Surface Mount; Number of Terminals: 2; Number of Terminations: 2; Packaging: Digi-Reel®; Power Rating: 16W; REACH SVHC: Yes; Tolerance: 1%; Width: 3.2mm; ComponentLink1URL: https://datasheet.octopart.com:443/CPA2512E1000FS-T10-Susumu-datasheet-113432870.pdf?src-supplier=IHS; ComponentLink1Description: https://datasheet.octopart.com:443/CPA2512E1000FS-T10-Susumu-datasheet-113432870.pdf?src-supplier=IHS; ComponentLink2URL: https://datasheet.octopart.com:443/CPA2512E1000FS-T10-Susumu-datasheet-17728680.pdf?src-supplier=Upverter; ComponentLink2Description: https://datasheet.octopart.com:443/CPA2512E1000FS-T10-Susumu-datasheet-17728680.pdf?src-supplier=Upverter; ComponentLink3URL: https://datasheet.octopart.com:443/CPA2512E1000FS-T10-Susumu-datasheet-12553808.pdf?src-supplier=Future+Electronics; ComponentLink3Description: https://datasheet.octopart.com:443/CPA2512E1000FS-T10-Susumu-datasheet-12553808.pdf?src-supplier=Future+Electronics
R4 = Thin Film D1MPAB2512QR015FA-T4: Res 0.015 Ohm 1% 2W 2512; Manufacturer: Thin Film Tech; Supplier: DigiKey; Supplier Part Number: 4463-D1MPAB2512QR015FA-T4TR-ND; Manufacturer Part Number: D1MPAB2512QR015FA-T4; Category: Chip SMD Resistors; Stock: 8740; Pricing: 4000=0,12012, 8000=0,11147, 12000=0,10703, 20000=0,10201, 28000=0,09902, 40000=0,09609 (USD)
R5 = Vishay CRCW06032R00FKEA: Res Thick Film 0603 2 Ohm 1% 0.1W(1/10W) ±100ppm/C Pad SMD T/R Automotive AEC-Q200; Manufacturer: Vishay; Power Rating: 100mW; Temperature Coefficient: 100ppm/°C; Voltage Rating: 75V; Supplier: Farnell; Supplier Part Number: CRCW06032R00FKEA; Manufacturer Part Number: CRCW06032R00FKEA; RoHS: Compliant; Category: Chip SMD Resistors; Stock: 30000; Pricing: 5000=0,0172 (GBP); Case/Package: 0603; Case Code (Imperial): 0603; Case Code (Metric): 1608; China RoHS: Non-Compliant; Composition: Thick Film; Contact Plating: Tin; Depth: 850µm; Height: 450µm; Lead Free: Lead Free; Length: 1.55mm; Lifecycle Status: Production; Max Operating Temperature: 155°C; Military Standard: Not; Min Operating Temperature: -55°C; Mounting Technology: Surface Mount; Pins: 2; Number of Terminals: 2; Packaging: Cut Tape; Radiation Hardening: No; Ratings: AEC-Q200; REACH SVHC: Yes; Schedule B: 8533210045, 8533210045|8533210045, 8533210045|8533210045|8533210045, 8533210045|8533210045|8533210045|8533210045; Termination: SMD/SMT; Tolerance: 1%; Voltage Rating (DC): 75V; Weight: 2.012816mg; Width: 850µm; Working Voltage: 75V; ComponentLink1URL: https://datasheet.octopart.com:443/CRCW06032R00FKEA-Vishay-datasheet-175423584.pdf?src-supplier=IHS; ComponentLink1Description: https://datasheet.octopart.com:443/CRCW06032R00FKEA-Vishay-datasheet-175423584.pdf?src-supplier=IHS; ComponentLink2URL: https://datasheet.octopart.com:443/CRCW06032R00FKEA-Vishay-datasheet-62316122.pdf?src-supplier=Future+Electronics; ComponentLink2Description: https://datasheet.octopart.com:443/CRCW06032R00FKEA-Vishay-datasheet-62316122.pdf?src-supplier=Future+Electronics; ComponentLink3URL: https://datasheet.octopart.com:443/CRCW06032R00FKEA-Vishay-datasheet-12519820.pdf?src-supplier=Future+Electronics; ComponentLink3Description: https://datasheet.octopart.com:443/CRCW06032R00FKEA-Vishay-datasheet-12519820.pdf?src-supplier=Future+Electronics; ComponentLink4URL: https://datasheet.octopart.com:443/CRCW06032R00FKEA-Vishay-datasheet-83961561.pdf?src-supplier=Newark; ComponentLink4Description: https://datasheet.octopart.com:443/CRCW06032R00FKEA-Vishay-datasheet-83961561.pdf?src-supplier=Newark; ComponentLink5URL: https://datasheet.octopart.com:443/CRCW06032R00FKEA-Vishay-datasheet-66077789.pdf?src-supplier=Newark; ComponentLink5Description: https://datasheet.octopart.com:443/CRCW06032R00FKEA-Vishay-datasheet-66077789.pdf?src-supplier=Newark; ComponentLink6URL: https://datasheet.octopart.com:443/CRCW06032R00FKEA-Vishay-datasheet-62317937.pdf?src-supplier=element14+APAC; ComponentLink6Description: https://datasheet.octopart.com:443/CRCW06032R00FKEA-Vishay-datasheet-62317937.pdf?src-supplier=element14+APAC; ComponentLink7URL: https://datasheet.octopart.com:443/CRCW06032R00FKEA-Vishay-datasheet-41302739.pdf?src-supplier=element14+APAC; ComponentLink7Description: https://datasheet.octopart.com:443/CRCW06032R00FKEA-Vishay-datasheet-41302739.pdf?src-supplier=element14+APAC; ComponentLink8URL: https://datasheet.octopart.com:443/CRCW06032R00FKEA-Vishay-datasheet-27121962.pdf?src-supplier=element14+APAC; ComponentLink8Description: https://datasheet.octopart.com:443/CRCW06032R00FKEA-Vishay-datasheet-27121962.pdf?src-supplier=element14+APAC; ComponentLink9URL: https://datasheet.octopart.com:443/CRCW06032R00FKEA-Vishay-datasheet-66077788.pdf?src-supplier=element14+APAC; ComponentLink9Description: https://datasheet.octopart.com:443/CRCW06032R00FKEA-Vishay-datasheet-66077788.pdf?src-supplier=element14+APAC; ComponentLink10URL: https://datasheet.octopart.com:443/CRCW06032R00FKEA-Vishay-Dale-datasheet-47688880.pdf?src-supplier=RS+(Formerly+Allied+Electronics); ComponentLink10Description: https://datasheet.octopart.com:443/CRCW06032R00FKEA-Vishay-Dale-datasheet-47688880.pdf?src-supplier=RS+(Formerly+Allied+Electronics); ComponentLink11URL: https://datasheet.octopart.com:443/CRCW06032R00FKEA-Vishay-datasheet-12001583.pdf?src-supplier=RS+(Formerly+Allied+Electronics); ComponentLink11Description: https://datasheet.octopart.com:443/CRCW06032R00FKEA-Vishay-datasheet-12001583.pdf?src-supplier=RS+(Formerly+Allied+Electronics); ComponentLink12URL: https://datasheet.octopart.com:443/CRCW06032R00FKEA-Vishay-datasheet-5306405.pdf?src-supplier=RS+(Formerly+Allied+Electronics); ComponentLink12Description: https://datasheet.octopart.com:443/CRCW06032R00FKEA-Vishay-datasheet-5306405.pdf?src-supplier=RS+(Formerly+Allied+Electronics); ComponentLink13URL: https://datasheet.octopart.com:443/CRCW06032R00FKEA-Vishay-datasheet-11540273.pdf?src-supplier=Arrow+Electronics; ComponentLink13Description: https://datasheet.octopart.com:443/CRCW06032R00FKEA-Vishay-datasheet-11540273.pdf?src-supplier=Arrow+Electronics; ComponentLink14URL: http://sigma.octopart.com:80/rohs_statement/Vishay-company-15.pdf?src-supplier=Compliance+Statements; ComponentLink14Description: http://sigma.octopart.com:80/rohs_statement/Vishay-company-15.pdf?src-supplier=Compliance+Statements
R6 = Vishay CRCW06034R75FKEAHP: Fixed Resistor, Metal Glaze/thick Film, 0.33W, 4.75ohm, 75V, 1% +/-Tol, 100ppm/Cel, Surface Mount, 0603; Manufacturer: Vishay; Max Power Dissipation: 250mW; Power Rating: 330mW; Temperature Coefficient: 100ppm/°C; Supplier: Future Electronics; Supplier Part Number: CRCW06034R75FKEAHP; Manufacturer Part Number: CRCW06034R75FKEAHP; RoHS: Compliant; Category: Chip SMD Resistors; Stock: 75000; Pricing: 5000=0,0456, 10000=0,0449, 20000=0,0442, 25000=0,044, 75000=0,0426 (USD); Case/Package: 0603; China RoHS: Non-Compliant; Composition: Thick Film; Features: Automotive AEC-Q200; Height: 450µm; Lead Free: Lead Free; Length: 1.6mm; Lifecycle Status: Production; Max Operating Temperature: 155°C; Min Operating Temperature: -55°C; Mounting Technology: Surface Mount; Number of Terminals: 2; Number of Terminations: 2; Packaging: Tape & Reel (TR); Ratings: AEC-Q200; REACH SVHC: Yes; Tolerance: 1%; Voltage Rating: 75V; Width: 850µm; Working Voltage: 75V; ComponentLink1URL: https://datasheet.octopart.com:443/CRCW06034R75FKEAHP-Vishay-datasheet-13148866.pdf?src-supplier=Upverter; ComponentLink1Description: https://datasheet.octopart.com:443/CRCW06034R75FKEAHP-Vishay-datasheet-13148866.pdf?src-supplier=Upverter; ComponentLink2URL: https://datasheet.octopart.com:443/CRCW06034R75FKEAHP-Vishay-datasheet-13131392.pdf?src-supplier=Upverter; ComponentLink2Description: https://datasheet.octopart.com:443/CRCW06034R75FKEAHP-Vishay-datasheet-13131392.pdf?src-supplier=Upverter; ComponentLink3URL: https://datasheet.octopart.com:443/CRCW06034R75FKEAHP-Vishay-datasheet-12593106.pdf?src-supplier=Upverter; ComponentLink3Description: https://datasheet.octopart.com:443/CRCW06034R75FKEAHP-Vishay-datasheet-12593106.pdf?src-supplier=Upverter; ComponentLink4URL: https://datasheet.octopart.com:443/CRCW06034R75FKEAHP-Vishay-datasheet-12544674.pdf?src-supplier=Upverter; ComponentLink4Description: https://datasheet.octopart.com:443/CRCW06034R75FKEAHP-Vishay-datasheet-12544674.pdf?src-supplier=Upverter; ComponentLink5URL: https://datasheet.octopart.com:443/CRCW06034R75FKEAHP-Vishay-datasheet-12531795.pdf?src-supplier=Upverter; ComponentLink5Description: https://datasheet.octopart.com:443/CRCW06034R75FKEAHP-Vishay-datasheet-12531795.pdf?src-supplier=Upverter; ComponentLink6URL: https://datasheet.octopart.com:443/CRCW06034R75FKEAHP-Vishay-datasheet-12518686.pdf?src-supplier=Upverter; ComponentLink6Description: https://datasheet.octopart.com:443/CRCW06034R75FKEAHP-Vishay-datasheet-12518686.pdf?src-supplier=Upverter; ComponentLink7URL: https://datasheet.octopart.com:443/CRCW06034R75FKEAHP-Vishay-datasheet-12509906.pdf?src-supplier=Upverter; ComponentLink7Description: https://datasheet.octopart.com:443/CRCW06034R75FKEAHP-Vishay-datasheet-12509906.pdf?src-supplier=Upverter; ComponentLink8URL: https://datasheet.octopart.com:443/CRCW06034R75FKEAHP-Vishay-datasheet-10669844.pdf?src-supplier=Upverter; ComponentLink8Description: https://datasheet.octopart.com:443/CRCW06034R75FKEAHP-Vishay-datasheet-10669844.pdf?src-supplier=Upverter; ComponentLink9URL: https://datasheet.octopart.com:443/CRCW06034R75FKEAHP-Vishay-datasheet-8703221.pdf?src-supplier=Upverter; ComponentLink9Description: https://datasheet.octopart.com:443/CRCW06034R75FKEAHP-Vishay-datasheet-8703221.pdf?src-supplier=Upverter; ComponentLink10URL: https://datasheet.octopart.com/CRCW06034R75FKEAHP-Vishay-datasheet-83567917.pdf; ComponentLink10Description: https://datasheet.octopart.com/CRCW06034R75FKEAHP-Vishay-datasheet-83567917.pdf; ComponentLink11URL: https://datasheet.octopart.com:443/CRCW06034R75FKEAHP-Vishay-datasheet-62316122.pdf?src-supplier=Future+Electronics; ComponentLink11Description: https://datasheet.octopart.com:443/CRCW06034R75FKEAHP-Vishay-datasheet-62316122.pdf?src-supplier=Future+Electronics; ComponentLink12URL: http://sigma.octopart.com:80/rohs_statement/Vishay-company-15.pdf?src-supplier=Compliance+Statements; ComponentLink12Description: http://sigma.octopart.com:80/rohs_statement/Vishay-company-15.pdf?src-supplier=Compliance+Statements
R7 = Vishay CRCW0603100KFKEAHP: Res Thick Film 0603 100K Ohm 1% 1/3W ±100ppm/°C Molded SMD SMD Paper T/R; Manufacturer: Vishay; Max Power Dissipation: 250mW; Power Rating: 330mW; Voltage Rating: 75V; Supplier: RS; Supplier Part Number: 8206745P; Manufacturer Part Number: CRCW0603100KFKEAHP; RoHS: Compliant; Category: Chip SMD Resistors; Stock: 5725; Pricing: 25=0,036 (EUR); Case/Package: 0603; Case Code (Imperial): 0603; Case Code (Metric): 1608; China RoHS: Non-Compliant; Composition: Thick Film; Contact Plating: Tin; Country of Origin: Israel; Depth: 850µm; Export Control Classification Number (ECCN) Code: EAR99; Features: Automotive AEC-Q200; Height: 450µm; Harmonized Tariff Schedule (HTS) Code: 8533.21.00.30; Introduction Date: 2008-07-29; Lead Free: Lead Free; Length: 1.6mm; Lifecycle Status: Production; Max Operating Temperature: 155°C; Military Standard: Not; Min Operating Temperature: -55°C; Mounting Technology: Surface Mount; Pins: 2; Number of Terminals: 2; Number of Terminations: 2; Packaging: Cut Tape; Radiation Hardening: No; Ratings: AEC-Q200; REACH SVHC: Yes; Schedule B: 8533210045, 8533210045|8533210045|8533210045|8533210045|8533210045; Temperature Coefficient: 100ppm/°C; Termination: SMD/SMT; Tolerance: 1%; Voltage Rating (DC): 75V; Weight: 2.012816mg; Width: 850µm; Working Voltage: 75V; ComponentLink1URL: https://datasheet.octopart.com:443/CRCW0603100KFKEAHP-Vishay-datasheet-13148866.pdf?src-supplier=Future+Electronics; ComponentLink1Description: https://datasheet.octopart.com:443/CRCW0603100KFKEAHP-Vishay-datasheet-13148866.pdf?src-supplier=Future+Electronics; ComponentLink2URL: https://datasheet.octopart.com:443/CRCW0603100KFKEAHP-Vishay-datasheet-13131392.pdf?src-supplier=Future+Electronics; ComponentLink2Description: https://datasheet.octopart.com:443/CRCW0603100KFKEAHP-Vishay-datasheet-13131392.pdf?src-supplier=Future+Electronics; ComponentLink3URL: https://datasheet.octopart.com:443/CRCW0603100KFKEAHP-Vishay-datasheet-12593106.pdf?src-supplier=Future+Electronics; ComponentLink3Description: https://datasheet.octopart.com:443/CRCW0603100KFKEAHP-Vishay-datasheet-12593106.pdf?src-supplier=Future+Electronics; ComponentLink4URL: https://datasheet.octopart.com:443/CRCW0603100KFKEAHP-Vishay-datasheet-12531795.pdf?src-supplier=Future+Electronics; ComponentLink4Description: https://datasheet.octopart.com:443/CRCW0603100KFKEAHP-Vishay-datasheet-12531795.pdf?src-supplier=Future+Electronics; ComponentLink5URL: https://datasheet.octopart.com:443/CRCW0603100KFKEAHP-Vishay-datasheet-12518686.pdf?src-supplier=Future+Electronics; ComponentLink5Description: https://datasheet.octopart.com:443/CRCW0603100KFKEAHP-Vishay-datasheet-12518686.pdf?src-supplier=Future+Electronics; ComponentLink6URL: https://datasheet.octopart.com:443/CRCW0603100KFKEAHP-Vishay-datasheet-12509906.pdf?src-supplier=Future+Electronics; ComponentLink6Description: https://datasheet.octopart.com:443/CRCW0603100KFKEAHP-Vishay-datasheet-12509906.pdf?src-supplier=Future+Electronics; ComponentLink7URL: https://datasheet.octopart.com:443/CRCW0603100KFKEAHP-Vishay-datasheet-10669844.pdf?src-supplier=Future+Electronics; ComponentLink7Description: https://datasheet.octopart.com:443/CRCW0603100KFKEAHP-Vishay-datasheet-10669844.pdf?src-supplier=Future+Electronics; ComponentLink8URL: https://datasheet.octopart.com:443/CRCW0603100KFKEAHP-Vishay-datasheet-8703221.pdf?src-supplier=Future+Electronics; ComponentLink8Description: https://datasheet.octopart.com:443/CRCW0603100KFKEAHP-Vishay-datasheet-8703221.pdf?src-supplier=Future+Electronics; ComponentLink9URL: https://datasheet.octopart.com:443/CRCW0603100KFKEAHP-Vishay-datasheet-62316122.pdf?src-supplier=Future+Electronics; ComponentLink9Description: https://datasheet.octopart.com:443/CRCW0603100KFKEAHP-Vishay-datasheet-62316122.pdf?src-supplier=Future+Electronics; ComponentLink10URL: https://datasheet.octopart.com:443/CRCW0603100KFKEAHP-Vishay-datasheet-12544674.pdf?src-supplier=_legacy+Avnet; ComponentLink10Description: https://datasheet.octopart.com:443/CRCW0603100KFKEAHP-Vishay-datasheet-12544674.pdf?src-supplier=_legacy+Avnet; ComponentLink11URL: https://datasheet.octopart.com:443/CRCW0603100KFKEAHP-Vishay-datasheet-87136057.pdf?src-supplier=Newark; ComponentLink11Description: https://datasheet.octopart.com:443/CRCW0603100KFKEAHP-Vishay-datasheet-87136057.pdf?src-supplier=Newark; ComponentLink12URL: https://datasheet.octopart.com:443/CRCW0603100KFKEAHP-Vishay-datasheet-66581887.pdf?src-supplier=Newark; ComponentLink12Description: https://datasheet.octopart.com:443/CRCW0603100KFKEAHP-Vishay-datasheet-66581887.pdf?src-supplier=Newark; ComponentLink13URL: https://datasheet.octopart.com:443/CRCW0603100KFKEAHP-Vishay-datasheet-37143532.pdf?src-supplier=Newark; ComponentLink13Description: https://datasheet.octopart.com:443/CRCW0603100KFKEAHP-Vishay-datasheet-37143532.pdf?src-supplier=Newark; ComponentLink14URL: https://datasheet.octopart.com:443/CRCW0603100KFKEAHP-Vishay-datasheet-8359436.pdf?src-supplier=Newark; ComponentLink14Description: https://datasheet.octopart.com:443/CRCW0603100KFKEAHP-Vishay-datasheet-8359436.pdf?src-supplier=Newark; ComponentLink15URL: https://datasheet.octopart.com:443/CRCW0603100KFKEAHP-Vishay-datasheet-112276998.pdf?src-supplier=Newark; ComponentLink15Description: https://datasheet.octopart.com:443/CRCW0603100KFKEAHP-Vishay-datasheet-112276998.pdf?src-supplier=Newark; ComponentLink16URL: https://datasheet.octopart.com:443/CRCW0603100KFKEAHP-Vishay-datasheet-62317933.pdf?src-supplier=element14+APAC; ComponentLink16Description: https://datasheet.octopart.com:443/CRCW0603100KFKEAHP-Vishay-datasheet-62317933.pdf?src-supplier=element14+APAC; ComponentLink17URL: https://datasheet.octopart.com/CRCW0603100KFKEAHP-Vishay-datasheet-83567917.pdf; ComponentLink17Description: https://datasheet.octopart.com/CRCW0603100KFKEAHP-Vishay-datasheet-83567917.pdf; ComponentLink18URL: https://datasheet.octopart.com:443/CRCW0603100KFKEAHP-Vishay-Dale-datasheet-47688881.pdf?src-supplier=RS+(Formerly+Allied+Electronics); ComponentLink18Description: https://datasheet.octopart.com:443/CRCW0603100KFKEAHP-Vishay-Dale-datasheet-47688881.pdf?src-supplier=RS+(Formerly+Allied+Electronics); ComponentLink19URL: http://sigma.octopart.com:80/rohs_statement/Vishay-company-15.pdf?src-supplier=Compliance+Statements; ComponentLink19Description: http://sigma.octopart.com:80/rohs_statement/Vishay-company-15.pdf?src-supplier=Compliance+Statements